# Altium schematic sheet Sec_Gate_Driver.SchDoc
size C; SheetNumber: 5; SheetTotal: 5
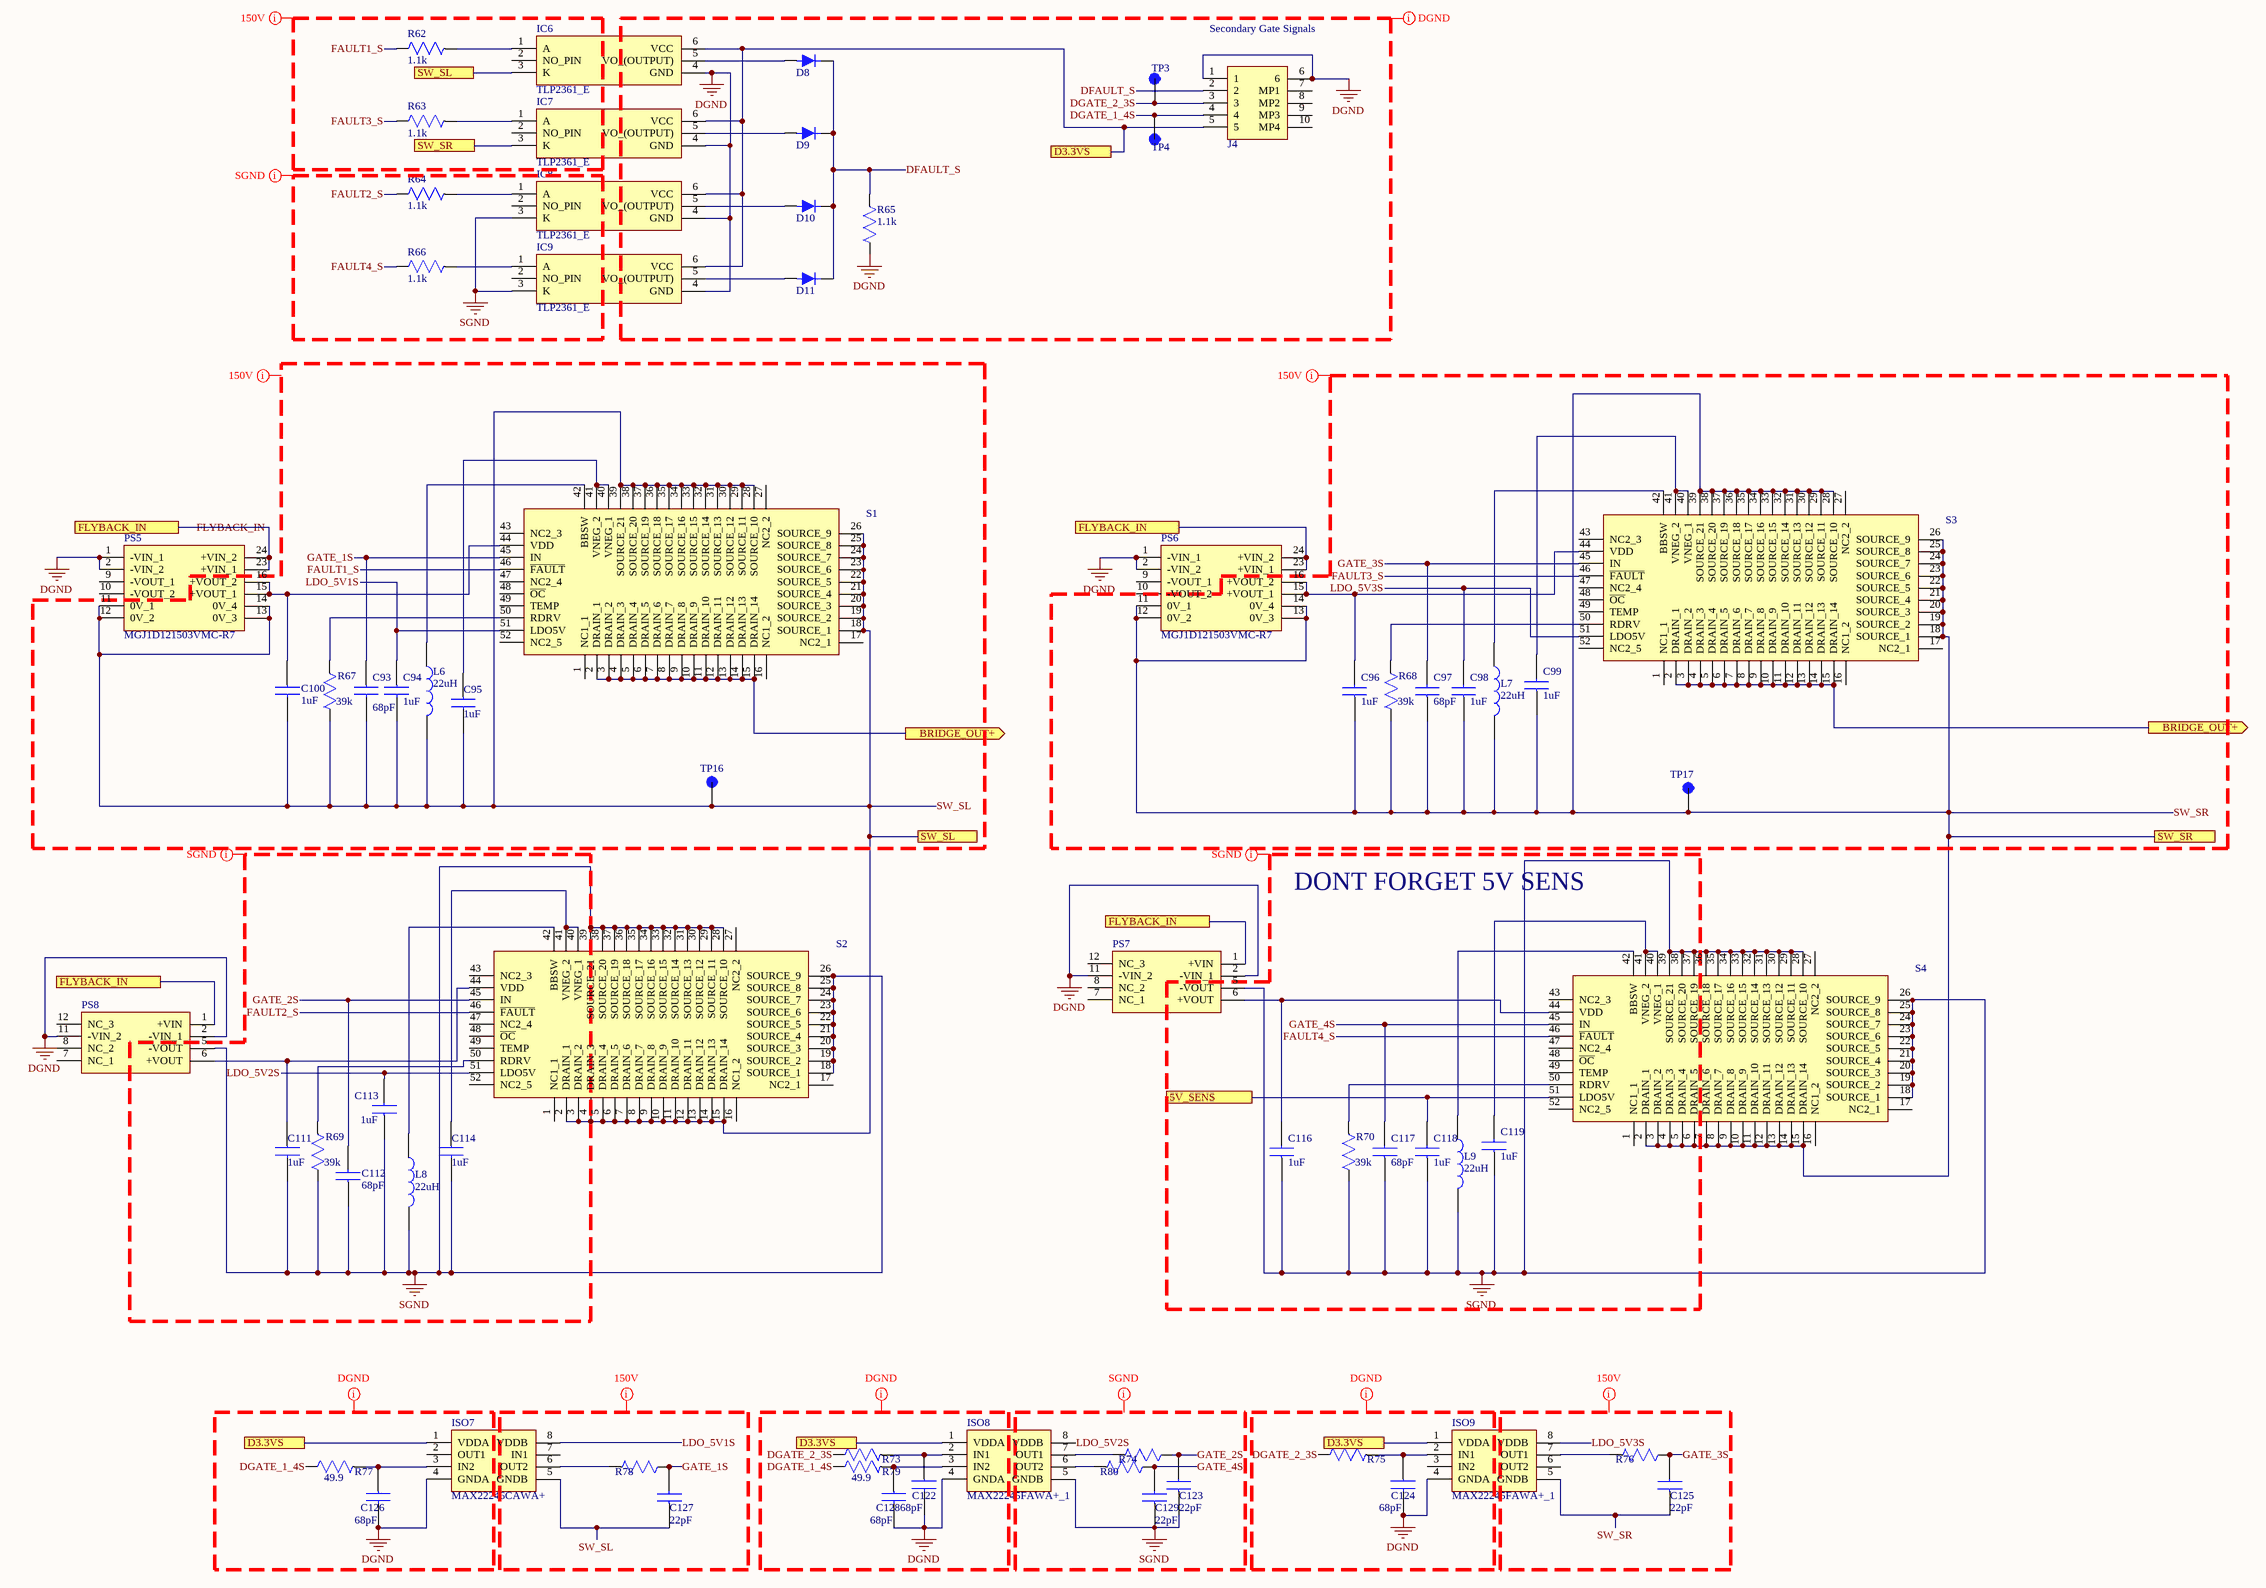
[diagram p0: Sec_Gate_Driver.SchDoc]

## Parts
C93  68pF  [C0805]
C94  1uF  [CAPC2012X135N]
C95  1uF  [CAPC2012X135N]
C96  1uF  [CAPC2012X70N]
C97  68pF  [C0805]
C98  1uF  [CAPC2012X135N]
C99  1uF  [CAPC2012X135N]
C100  1uF  [CAPC2012X135N]
C111  1uF  [CAPC2012X135N]
C112  68pF  [C0805]
C113  1uF  [CAPC2012X70N]
C114  1uF  [CAPC2012X135N]
C116  1uF  [CAPC2012X70N]
C117  68pF  [C0805]
C118  1uF  [CAPC2012X70N]
C119  1uF  [CAPC2012X70N]
C122  68pF  [C0805]
C123  22pF  [C0805]
C124  68pF  [C0805]
C125  22pF  [C0805]
C126  68pF  [C0805]
C127  22pF  [C0805]
C128  68pF  [C0805]
C129  22pF  [C0805]
D8  CUS520,H3F  [SOD2513X115N]  (value not drawn)
D9  CUS520,H3F  [SOD2513X115N]  (value not drawn)
D10  CUS520,H3F  [SOD2513X115N]  (value not drawn)
D11  CUS520,H3F  [SOD2513X115N]  (value not drawn)
IC6  TLP2361_E  [SOIC127P700X230-6N]
IC7  TLP2361_E  [SOIC127P700X230-6N]
IC8  TLP2361_E  [SOIC127P700X230-6N]
IC9  TLP2361_E  [SOIC127P700X230-6N]
ISO7  MAX22246CAWA+  [SOIC127P1031X265-8N]
ISO8  MAX22245FAWA+_1  [SOIC127P1031X265-8N]
ISO9  MAX22245FAWA+_1  [SOIC127P1031X265-8N]
J4  0527450696  [0527450696]  (value not drawn)
L6  22uH  [LQM21DN220N00L]
L7  22uH  [LQM21DN220N00L]
L8  22uH  [LQM21DN220N00L]
L9  22uH  [LQM21DN220N00L]
PS5  MGJ1D121503VMC-R7  [MGJ1D121503VMCR7]
PS6  MGJ1D121503VMC-R7  [MGJ1D121503VMCR7]
PS7  NXJ2S1212MC-R7  [NXJ2S1212MCR7]  (value not drawn)
PS8  NXJ2S1212MC-R7  [NXJ2S1212MCR7]  (value not drawn)
R62  1.1k  [RESC2012X60N]
R63  1.1k  [RESC2012X60N]
R64  1.1k  [RESC2012X60N]
R65  1.1k  [RESC2012X60N]
R66  1.1k  [RESC2012X60N]
R67  39k  [C0805]
R68  39k  [C0805]
R69  39k  [ERJP06D1000V]
R70  39k  [C0805]
R73  49.9  [RESC2013X84N]  (value not drawn)
R74  49.9  [RESC2013X84N]  (value not drawn)
R75  49.9  [RESC2013X84N]  (value not drawn)
R76  49.9  [RESC2013X84N]  (value not drawn)
R77  49.9  [RESC2013X84N]
R78  49.9  [RESC2013X84N]  (value not drawn)
R79  49.9  [RESC2013X84N]
R80  49.9  [RESC2013X84N]  (value not drawn)
S1  LMG3522R030RQSR  [LMG3522R050RQSR]  (value not drawn)
S2  LMG3522R030RQSR  [LMG3522R050RQSR]  (value not drawn)
S3  LMG3522R030RQSR  [LMG3522R050RQSR]  (value not drawn)
S4  LMG3522R030RQSR  [LMG3522R050RQSR]  (value not drawn)
TP3  Test Point 5011  [TP_5011]  (value not drawn)
TP4  Test Point 5011  [TP_5011]  (value not drawn)
TP16  Secondary Switch Node Left  [TP_5011]  (value not drawn)
TP17  Switch Node Secondary Right  [TP_5011]  (value not drawn)

## Ports
5V_SENS (see Sensing[5B], Sensing[5C]), BRIDGE_OUT+ (out, see Power_Board[4B], Sec_Gate_Driver[3B], Sensing[1C]), BRIDGE_OUT+ (out, see Power_Board[4B], Sec_Gate_Driver[6B], Sensing[1C]), D3.3VS (see Sensing[4B], Sensing[4C]), FLYBACK_IN (see Aux_Power[5A], Pri_Gate_Driver[1B], Pri_Gate_Driver[1C], Pri_Gate_Driver[4B], Pri_Gate_Driver[4C], Sec_Gate_Driver[1B], Sec_Gate_Driver[1C], Sec_Gate_Driver[3B], Sensing[1B]), FLYBACK_IN (see Aux_Power[5A], Pri_Gate_Driver[1B], Pri_Gate_Driver[1C], Pri_Gate_Driver[4B], Pri_Gate_Driver[4C], Sec_Gate_Driver[1B], Sec_Gate_Driver[1C], Sec_Gate_Driver[3C], Sensing[1B]), FLYBACK_IN (see Aux_Power[5A], Pri_Gate_Driver[1B], Pri_Gate_Driver[1C], Pri_Gate_Driver[4B], Pri_Gate_Driver[4C], Sec_Gate_Driver[1B], Sec_Gate_Driver[3B], Sec_Gate_Driver[3C], Sensing[1B]), FLYBACK_IN (see Aux_Power[5A], Pri_Gate_Driver[1B], Pri_Gate_Driver[1C], Pri_Gate_Driver[4B], Pri_Gate_Driver[4C], Sec_Gate_Driver[1C], Sec_Gate_Driver[3B], Sec_Gate_Driver[3C], Sensing[1B]), SW_SL (see Power_Board[4C], Sec_Gate_Driver[2A]), SW_SL (see Power_Board[4C], Sec_Gate_Driver[3B]), SW_SR (see Power_Board[4B], Sec_Gate_Driver[2A]), SW_SR (see Power_Board[4B], Sec_Gate_Driver[6B])

## Nets
DGND: C122.2 C124.2 C126.2 C128.2 IC6.4(GND) IC7.4(GND) IC8.4(GND) IC9.4(GND) ISO7.4(GNDA) ISO8.4(GNDA) ISO9.4(GNDA) J4.1 J4.6 PS5.1(-VIN_1) PS5.2(-VIN_2) PS6.1(-VIN_1) PS6.2(-VIN_2) PS7.2(-VIN_1) PS7.11(-VIN_2) PS8.2(-VIN_1) PS8.11(-VIN_2) R65.1
SGND: C111.2 C112.1 C113.1 C114.2 C116.1 C117.1 C118.1 C119.1 C123.1 C129.1 IC8.3(K) IC9.3(K) ISO8.5(GNDB) L8.2 L9.2 PS7.5(-VOUT) PS8.5(-VOUT) R69.1 R70.1 S2.18(SOURCE_1) S2.19(SOURCE_2) S2.20(SOURCE_3) S2.21(SOURCE_4) S2.22(SOURCE_5) S2.23(SOURCE_6) S2.24(SOURCE_7) S2.25(SOURCE_8) S2.26(SOURCE_9) S2.28(SOURCE_10) S2.29(SOURCE_11) S2.30(SOURCE_12) S2.31(SOURCE_13) S2.32(SOURCE_14) S2.33(SOURCE_15) S2.34(SOURCE_16) S2.35(SOURCE_17) S2.36(SOURCE_18) S2.37(SOURCE_19) S2.38(SOURCE_20) S2.39(SOURCE_21) S4.18(SOURCE_1) S4.19(SOURCE_2) S4.20(SOURCE_3) S4.21(SOURCE_4) S4.22(SOURCE_5) S4.23(SOURCE_6) S4.24(SOURCE_7) S4.25(SOURCE_8) S4.26(SOURCE_9) S4.28(SOURCE_10) S4.29(SOURCE_11) S4.30(SOURCE_12) S4.31(SOURCE_13) S4.32(SOURCE_14) S4.33(SOURCE_15) S4.34(SOURCE_16) S4.35(SOURCE_17) S4.36(SOURCE_18) S4.37(SOURCE_19) S4.38(SOURCE_20) S4.39(SOURCE_21)
5V_SENS: C118.2 S4.51(LDO5V) ; port 5V_SENS
BRIDGE_OUT+: S1.2(DRAIN_1) S1.3(DRAIN_2) S1.4(DRAIN_3) S1.5(DRAIN_4) S1.6(DRAIN_5) S1.7(DRAIN_6) S1.8(DRAIN_7) S1.9(DRAIN_8) S1.10(DRAIN_9) S1.11(DRAIN_10) S1.12(DRAIN_11) S1.13(DRAIN_12) S1.14(DRAIN_13) S1.15(DRAIN_14) S3.2(DRAIN_1) S3.3(DRAIN_2) S3.4(DRAIN_3) S3.5(DRAIN_4) S3.6(DRAIN_5) S3.7(DRAIN_6) S3.8(DRAIN_7) S3.9(DRAIN_8) S3.10(DRAIN_9) S3.11(DRAIN_10) S3.12(DRAIN_11) S3.13(DRAIN_12) S3.14(DRAIN_13) S3.15(DRAIN_14) ; port BRIDGE_OUT+
D3.3VS: IC6.6(VCC) IC7.6(VCC) IC8.6(VCC) IC9.6(VCC) ISO7.1(VDDA) ISO8.1(VDDA) ISO9.1(VDDA) J4.5 ; port D3.3VS
DFAULT_S: D8.2 D9.2 D10.2 D11.2 J4.2 R65.2
DGATE_1_4S: J4.4 R77.1 R79.1 TP4.1
DGATE_2_3S: J4.3 R73.1 R75.1 TP3.1
FAULT1_S: R62.1 S1.46(~{FAULT})
FAULT2_S: R64.1 S2.46(~{FAULT})
FAULT3_S: R63.1 S3.46(~{FAULT})
FAULT4_S: R66.1 S4.46(~{FAULT})
FLYBACK_IN: PS5.23(+VIN_1) PS5.24(+VIN_2) PS6.23(+VIN_1) PS6.24(+VIN_2) PS7.1(+VIN) PS8.1(+VIN) ; port FLYBACK_IN
GATE_1S: C93.1 C127.2 R78.1 S1.45(IN)
GATE_2S: C112.2 C123.2 R74.1 S2.45(IN)
GATE_3S: C97.2 C125.2 R76.1 S3.45(IN)
GATE_4S: C117.2 C129.2 R80.1 S4.45(IN)
LDO_5V1S: C94.1 ISO7.8(VDDB) S1.51(LDO5V)
LDO_5V2S: C113.2 ISO8.8(VDDB) S2.51(LDO5V)
LDO_5V3S: C98.2 ISO9.8(VDDB) S3.51(LDO5V)
SW_SL: C93.2 C94.2 C95.2 C100.2 C127.1 IC6.3(K) ISO7.5(GNDB) L6.2 PS5.11(0V_1) PS5.12(0V_2) PS5.13(0V_3) PS5.14(0V_4) R67.1 S1.18(SOURCE_1) S1.19(SOURCE_2) S1.20(SOURCE_3) S1.21(SOURCE_4) S1.22(SOURCE_5) S1.23(SOURCE_6) S1.24(SOURCE_7) S1.25(SOURCE_8) S1.26(SOURCE_9) S1.28(SOURCE_10) S1.29(SOURCE_11) S1.30(SOURCE_12) S1.31(SOURCE_13) S1.32(SOURCE_14) S1.33(SOURCE_15) S1.34(SOURCE_16) S1.35(SOURCE_17) S1.36(SOURCE_18) S1.37(SOURCE_19) S1.38(SOURCE_20) S1.39(SOURCE_21) S2.2(DRAIN_1) S2.3(DRAIN_2) S2.4(DRAIN_3) S2.5(DRAIN_4) S2.6(DRAIN_5) S2.7(DRAIN_6) S2.8(DRAIN_7) S2.9(DRAIN_8) S2.10(DRAIN_9) S2.11(DRAIN_10) S2.12(DRAIN_11) S2.13(DRAIN_12) S2.14(DRAIN_13) S2.15(DRAIN_14) TP16.1 ; port SW_SL
SW_SR: C96.1 C97.1 C98.1 C99.1 C125.1 IC7.3(K) ISO9.5(GNDB) L7.2 PS6.11(0V_1) PS6.12(0V_2) PS6.13(0V_3) PS6.14(0V_4) R68.1 S3.18(SOURCE_1) S3.19(SOURCE_2) S3.20(SOURCE_3) S3.21(SOURCE_4) S3.22(SOURCE_5) S3.23(SOURCE_6) S3.24(SOURCE_7) S3.25(SOURCE_8) S3.26(SOURCE_9) S3.28(SOURCE_10) S3.29(SOURCE_11) S3.30(SOURCE_12) S3.31(SOURCE_13) S3.32(SOURCE_14) S3.33(SOURCE_15) S3.34(SOURCE_16) S3.35(SOURCE_17) S3.36(SOURCE_18) S3.37(SOURCE_19) S3.38(SOURCE_20) S3.39(SOURCE_21) S4.2(DRAIN_1) S4.3(DRAIN_2) S4.4(DRAIN_3) S4.5(DRAIN_4) S4.6(DRAIN_5) S4.7(DRAIN_6) S4.8(DRAIN_7) S4.9(DRAIN_8) S4.10(DRAIN_9) S4.11(DRAIN_10) S4.12(DRAIN_11) S4.13(DRAIN_12) S4.14(DRAIN_13) S4.15(DRAIN_14) TP17.1 ; port SW_SR
NetC95_1: C95.1 S1.40(VNEG_1) S1.41(VNEG_2)
NetC96_2: C96.2 PS6.15(+VOUT_1) PS6.16(+VOUT_2) S3.44(VDD)
NetC99_2: C99.2 S3.40(VNEG_1) S3.41(VNEG_2)
NetC100_1: C100.1 PS5.15(+VOUT_1) PS5.16(+VOUT_2) S1.44(VDD)
NetC111_1: C111.1 PS8.6(+VOUT) S2.44(VDD)
NetC114_1: C114.1 S2.40(VNEG_1) S2.41(VNEG_2)
NetC116_2: C116.2 PS7.6(+VOUT) S4.44(VDD)
NetC119_2: C119.2 S4.40(VNEG_1) S4.41(VNEG_2)
NetC122_1: C122.1 ISO8.2(IN1) R73.2
NetC124_1: C124.1 ISO9.2(IN1) R75.2
NetC126_1: C126.1 ISO7.3(IN2) R77.2
NetC128_1: C128.1 ISO8.3(IN2) R79.2
NetD8_1: D8.1 IC6.5(VO_(OUTPUT))
NetD9_1: D9.1 IC7.5(VO_(OUTPUT))
NetD10_1: D10.1 IC8.5(VO_(OUTPUT))
NetD11_1: D11.1 IC9.5(VO_(OUTPUT))
NetIC6_1: IC6.1(A) R62.2
NetIC7_1: IC7.1(A) R63.2
NetIC8_1: IC8.1(A) R64.2
NetIC9_1: IC9.1(A) R66.2
NetISO7_6: ISO7.6(OUT2) R78.2
NetISO8_6: ISO8.6(OUT2) R80.2
NetISO8_7: ISO8.7(OUT1) R74.2
NetISO9_7: ISO9.7(OUT1) R76.2
NetL6_1: L6.1 S1.42(BBSW)
NetL7_1: L7.1 S3.42(BBSW)
NetL8_1: L8.1 S2.42(BBSW)
NetL9_1: L9.1 S4.42(BBSW)
NetR67_2: R67.2 S1.50(RDRV)
NetR68_2: R68.2 S3.50(RDRV)
NetR69_2: R69.2 S2.50(RDRV)
NetR70_2: R70.2 S4.50(RDRV)

Not connected (* = marked no-connect by the designer): IC6 2(NO_PIN); IC7 2(NO_PIN); IC8 2(NO_PIN); IC9 2(NO_PIN); ISO7 2(OUT1) 7(IN1); ISO9 3(IN2) 6(OUT2); J4 7(MP1) 8(MP2) 9(MP3) 10(MP4); PS5 9(-VOUT_1) 10(-VOUT_2); PS6 9(-VOUT_1) 10(-VOUT_2); PS7 7(NC_1) 8(NC_2) 12(NC_3); PS8 7(NC_1) 8(NC_2) 12(NC_3); S1 1(NC1_1) 16(NC1_2) 17(NC2_1) 27(NC2_2) 43(NC2_3) 47(NC2_4) 48(~{OC}) 49(TEMP) 52(NC2_5); S2 1(NC1_1) 16(NC1_2) 17(NC2_1) 27(NC2_2) 43(NC2_3) 47(NC2_4) 48(~{OC}) 49(TEMP) 52(NC2_5); S3 1(NC1_1) 16(NC1_2) 17(NC2_1) 27(NC2_2) 43(NC2_3) 47(NC2_4) 48(~{OC}) 49(TEMP) 52(NC2_5); S4 1(NC1_1) 16(NC1_2) 17(NC2_1) 27(NC2_2) 43(NC2_3) 47(NC2_4) 48(~{OC}) 49(TEMP) 52(NC2_5)

## Layout directives
net class 150V: FAULT1_S, FAULT3_S, GATE_1S, GATE_3S, LDO_5V1S, LDO_5V3S, SW_SL, SW_SR
net class SGND: FAULT2_S, FAULT4_S, GATE_2S, GATE_4S, LDO_5V2S, SGND
net class DGND: DFAULT_S, DGATE_1_4S, DGATE_2_3S, DGND

## Notes on the sheet
- (near J4) Secondary Gate Signals
- DONT FORGET 5V SENS

## Library data of the parts
C93 = C0805C680J5GACTU: Capacitor; Manufacturer_Name: KEMET; Datasheet Link: https://content.kemet.com/datasheets/KEM_C1003_C0G_SMD.pdf; Height: 1.1mm; Manufacturer_Part_Number: C0805C680J5GACTU; Mouser Part Number: 80-C0805C680J5G; Mouser Price/Stock: https://www.mouser.co.uk/ProductDetail/KEMET/C0805C680J5GACTU?qs=6TVATEUodcRQxIollGm9Gg%3D%3D
C94 C95 C100 C111 C114 = CL21B105KBFNNNE: Capacitor; Manufacturer_Name: SAMSUNG; Datasheet Link: https://componentsearchengine.com/Datasheets/2/CL21B105KBFNNNE.pdf; Height: 1.35mm; Manufacturer_Part_Number: CL21B105KBFNNNE; Mouser Part Number: 187-CL21B105KBFNNNE; Mouser Price/Stock: https://www.mouser.co.uk/ProductDetail/Samsung-Electro-Mechanics/CL21B105KBFNNNE?qs=yOVawPpwOwmddQEBPU6Y9A%3D%3D; Arrow Part Number: CL21B105KBFNNNE; Arrow Price/Stock: https://www.arrow.com/en/products/cl21b105kbfnnne/samsung-electro-mechanics?region=europe
C96 C98 C99 C113 C116 C118 C119 = CL21B105KBFNNNE: CAP CER 1UF 50V X7R 0805; Manufacturer_Name: SAMSUNG; Datasheet Link: https://componentsearchengine.com/Datasheets/2/CL21B105KBFNNNE.pdf; Height: 1.35mm; Manufacturer_Part_Number: CL21B105KBFNNNE; Mouser Part Number: 187-CL21B105KBFNNNE; Mouser Price/Stock: https://www.mouser.co.uk/ProductDetail/Samsung-Electro-Mechanics/CL21B105KBFNNNE?qs=yOVawPpwOwmddQEBPU6Y9A%3D%3D; Arrow Part Number: CL21B105KBFNNNE; Arrow Price/Stock: https://www.arrow.com/en/products/cl21b105kbfnnne/samsung-electro-mechanics?region=europe
C97 C117 = C0805C680J5GACTU: CAP CER 68PF 50V C0G/NP0 0805; Manufacturer_Name: KEMET; Datasheet Link: https://content.kemet.com/datasheets/KEM_C1003_C0G_SMD.pdf; Height: 1.1mm; Manufacturer_Part_Number: C0805C680J5GACTU; Mouser Part Number: 80-C0805C680J5G; Mouser Price/Stock: https://www.mouser.co.uk/ProductDetail/KEMET/C0805C680J5GACTU?qs=6TVATEUodcRQxIollGm9Gg%3D%3D
C112 C122 C124 C126 C128 = C0805C680J5GACTU_1: CAP CER 68PF 50V C0G/NP0 0805; Manufacturer_Name: KEMET; Datasheet Link: https://content.kemet.com/datasheets/KEM_C1003_C0G_SMD.pdf; Height: 1.1mm; Manufacturer_Part_Number: C0805C680J5GACTU; Mouser Part Number: 80-C0805C680J5G; Mouser Price/Stock: https://www.mouser.co.uk/ProductDetail/KEMET/C0805C680J5GACTU?qs=6TVATEUodcRQxIollGm9Gg%3D%3D
C123 C125 C127 C129 = C0805C220J1GACTU: CAP CER 22PF 100V C0G/NP0 0805; Manufacturer_Name: KEMET; Datasheet Link: https://content.kemet.com/datasheets/KEM_C1003_C0G_SMD.pdf; Height: 1.1mm; Manufacturer_Part_Number: C0805C220J1GACTU; Mouser Part Number: 80-C0805C220J1G; Mouser Price/Stock: https://www.mouser.co.uk/ProductDetail/KEMET/C0805C220J1GACTU?qs=43LhqrlLHAWrlSFTo8H45g%3D%3D; Arrow Part Number: C0805C220J1GACTU; Arrow Price/Stock: https://www.arrow.com/en/products/c0805c220j1gactu/kemet-corporation
D8-D11 = CUS520,H3F: DIODE SCHOTTKY 30V 200MA USC; Manufacturer_Name: onsemi; Manufacturer_Part_Number: MMSD4148T1G; Datasheet Link: https://www.onsemi.com/pub/Collateral/MMSD4148T1-D.PDF; Height: 1.35mm; Mouser Part Number: 863-MMSD4148T1G; Mouser Price/Stock: https://www.mouser.co.uk/ProductDetail/onsemi/MMSD4148T1G?qs=P4IOph%252Bbot9zwOmK%2F4hkww%3D%3D; Arrow Part Number: MMSD4148T1G; Arrow Price/Stock: https://www.arrow.com/en/products/mmsd4148t1g/on-semiconductor?utm_currency=USD&region=europe
IC6-IC9 = TLP2361_E: Integrated Circuit; Manufacturer_Name: Toshiba; Manufacturer_Part_Number: TLP2361(E; Datasheet Link: https://toshiba.semicon-storage.com/info/docget.jsp?did=14229&prodName=TLP2361; Height: 2.3mm; Mouser Part Number: 757-TLP2361(E; Mouser Price/Stock: https://www.mouser.co.uk/ProductDetail/Toshiba/TLP2361E?qs=HVbQlW5zcXW54RRsl7V%2FMQ%3D%3D; Arrow Part Number: TLP2361(E; Arrow Price/Stock: https://www.arrow.com/en/products/tlp2361-e/toshiba?utm_currency=USD&region=nac
ISO7 = MAX22246CAWA+: DG ISO 5KV 2CH CAN/RS232 8-SOIC; Manufacturer_Name: Analog Devices; Datasheet Link: https://datasheets.maximintegrated.com/en/ds/MAX22245-MAX22246.pdf; Height: 2.65mm; Manufacturer_Part_Number: MAX22246CAWA+; Mouser Part Number: 700-MAX22246CAWA+; Mouser Price/Stock: https://www.mouser.co.uk/ProductDetail/Analog-Devices-Maxim-Integrated/MAX22246CAWA%2b?qs=DPoM0jnrROXVfsS9dCX1xg%3D%3D; Arrow Part Number: MAX22246CAWA+; Arrow Price/Stock: https://www.arrow.com/en/products/max22246cawa/maxim-integrated?region=nac
ISO8 ISO9 = MAX22245FAWA+_1: DG ISO 5KV 2CH CAN/RS232 8-SOIC; Manufacturer_Name: Analog Devices; Datasheet Link: https://datasheets.maximintegrated.com/en/ds/MAX22245-MAX22246.pdf; Height: 2.65mm; Manufacturer_Part_Number: MAX22245FAWA+
J4 = 0527450696: CONN FFC FPC TOP 6POS 0.5MM R/A; Manufacturer_Name: Molex; Datasheet Link: https://www.molex.com/content/dam/molex/molex-dot-com/products/automated/en-us/salesdrawingpdf/527/52745/527450696_sd.pdf?inline; Height: 2mm; Manufacturer_Part_Number: 0527450696; Mouser Part Number: N/A; Mouser Price/Stock: https://www.mouser.co.uk/ProductDetail/Molex/0527450696?qs=PBcRNPEHKspDQteIzUIw7A%3D%3D; Arrow Part Number: 0527450696; Arrow Price/Stock: null?region=nac
L6 L8 = LQM21DH220M70L: Inductor; Manufacturer_Name: Murata Electronics; Datasheet Link: https://search.murata.co.jp/Ceramy/image/img/P02/JELF243B-9125.pdf; Height: 1.45mm; Manufacturer_Part_Number: LQM21DH220M70L; Mouser Part Number: 81-LQM21DH220M70L; Mouser Price/Stock: https://www.mouser.co.uk/ProductDetail/Murata-Electronics/LQM21DH220M70L?qs=17u8i%2FzlE8%252Bd%252BGaSnwbMPw%3D%3D; Arrow Part Number: LQM21DH220M70L; Arrow Price/Stock: https://www.arrow.com/en/products/lqm21dh220m70l/murata-manufacturing
L7 L9 = LQM21DH220M70L: FIXED IND 22UH 220MA 1.625OHM SM; Manufacturer_Name: Murata Electronics; Datasheet Link: https://search.murata.co.jp/Ceramy/image/img/P02/JELF243B-9125.pdf; Height: 1.45mm; Manufacturer_Part_Number: LQM21DH220M70L; Mouser Part Number: 81-LQM21DH220M70L; Mouser Price/Stock: https://www.mouser.co.uk/ProductDetail/Murata-Electronics/LQM21DH220M70L?qs=17u8i%2FzlE8%252Bd%252BGaSnwbMPw%3D%3D; Arrow Part Number: LQM21DH220M70L; Arrow Price/Stock: https://www.arrow.com/en/products/lqm21dh220m70l/murata-manufacturing
PS5 PS6 = MGJ1D121503VMC-R7: DC DC CONVERTER 15V -3V 1W; Manufacturer_Name: Murata Electronics; Datasheet Link: https://www.murata.com.cn/products/productdata/8826773962782/KDC-MGJ1V.pdf?1720063814000; Height: 4.95mm; Manufacturer_Part_Number: MGJ1D121503VMC-R7; Mouser Part Number: 580-MGJ1D121503VMCR7; Mouser Price/Stock: https://www.mouser.co.uk/ProductDetail/Murata-Power-Solutions/MGJ1D121503VMC-R7?qs=IKkN%2F947nfAXIvidLatSTQ%3D%3D
PS7 PS8 = NXJ2S1212MC-R7: DC DC CONVERTER 12V 2W; Manufacturer_Name: Murata Electronics; Datasheet Link: https://www.mouser.com/datasheet/2/281/kdc_nxj2-1368015.pdf; Height: 4.86mm; Manufacturer_Part_Number: NXJ2S1212MC-R7; Mouser Part Number: 580-NXJ2S1212MC-R7; Mouser Price/Stock: https://www.mouser.co.uk/ProductDetail/Murata-Power-Solutions/NXJ2S1212MC-R7?qs=MLItCLRbWswcHTaOUWcyaw%3D%3D; Arrow Part Number: NXJ2S1212MC-R7; Arrow Price/Stock: https://www.arrow.com/en/products/nxj2s1212mc-r7/murata-power-solutions
R62-R66 = RMCF0805JT1K10: RES 1.1K OHM 5% 1/8W 0805; Manufacturer_Name: Panasonic; Manufacturer_Part_Number: ERJ-PB6B1002V; Datasheet Link: https://componentsearchengine.com/Datasheets/1/ERJ-PB6B1002V.pdf; Height: 0.7mm; Mouser Part Number: 667-ERJ-PB6B1002V; Mouser Price/Stock: https://www.mouser.co.uk/ProductDetail/Panasonic/ERJ-PB6B1002V?qs=eFOtW6xYNWFfvuWzLzq%2FIQ%3D%3D; Arrow Part Number: ERJ-PB6B1002V; Arrow Price/Stock: https://www.arrow.com/en/products/erj-pb6b1002v/panasonic?region=nac
R67-R70 = ERJ-PB6B3902V: 39 kOhms ±0.1% 0.25W, 1/4W Chip Resistor 0805 (2012 Metric) Automotive AEC-Q200 Thick Film; Manufacturer_Name: KEMET; Manufacturer_Part_Number: RC0603JR0710KL; Datasheet Link: http://www.yageo.com/documents/recent/PYu-RC0603_51_RoHS_L_v5.pdf; Height: 0.55mm; Arrow Part Number: RC0603JR0710KL; Arrow Price/Stock: https://www.arrow.com/en/products/rc0603jr-0710kl/yageo?region=nac
R73-R80 = PCAN0805E49R9BST5: RES SMD 49.9 OHM 0.1% 1W 0805; Manufacturer_Name: Vishay; Datasheet Link: https://altium.componentsearchengine.com/Datasheets/1/PCAN0805E49R9BST5.pdf; Height: 0.838mm; Manufacturer_Part_Number: PCAN0805E49R9BST5; Mouser Part Number: 71-PCAN0805E49R9BST5; Mouser Price/Stock: https://www.mouser.co.uk/ProductDetail/Vishay-Thin-Film/PCAN0805E49R9BST5?qs=0KABoAvMNWeDPZ7%2F3japZQ%3D%3D
S1-S4 = LMG3522R050RQSR: Integrated Circuit; Manufacturer_Name: Texas Instruments; Datasheet Link: https://www.ti.com/lit/ds/symlink/lmg3522r050.pdf?ts=1715626781330&ref_url=https%253A%252F%252Fwww.ti.com%252Fproduct%252FLMG3522R050; Height: 1mm; Manufacturer_Part_Number: LMG3522R050RQSR; Mouser Part Number: 595-LMG3522R050RQSR; Mouser Price/Stock: https://www.mouser.co.uk/ProductDetail/Texas-Instruments/LMG3522R050RQSR?qs=HoCaDK9Nz5eObfyI2hqfkQ%3D%3D
TP3 TP4 TP16 TP17 = Test Point 5011: MP: altium_native_batch; Value: *; Availability: Unavailable; Price: None; Package: None